# EAGLE design Truss-Power (EAGLE 7.7.0)
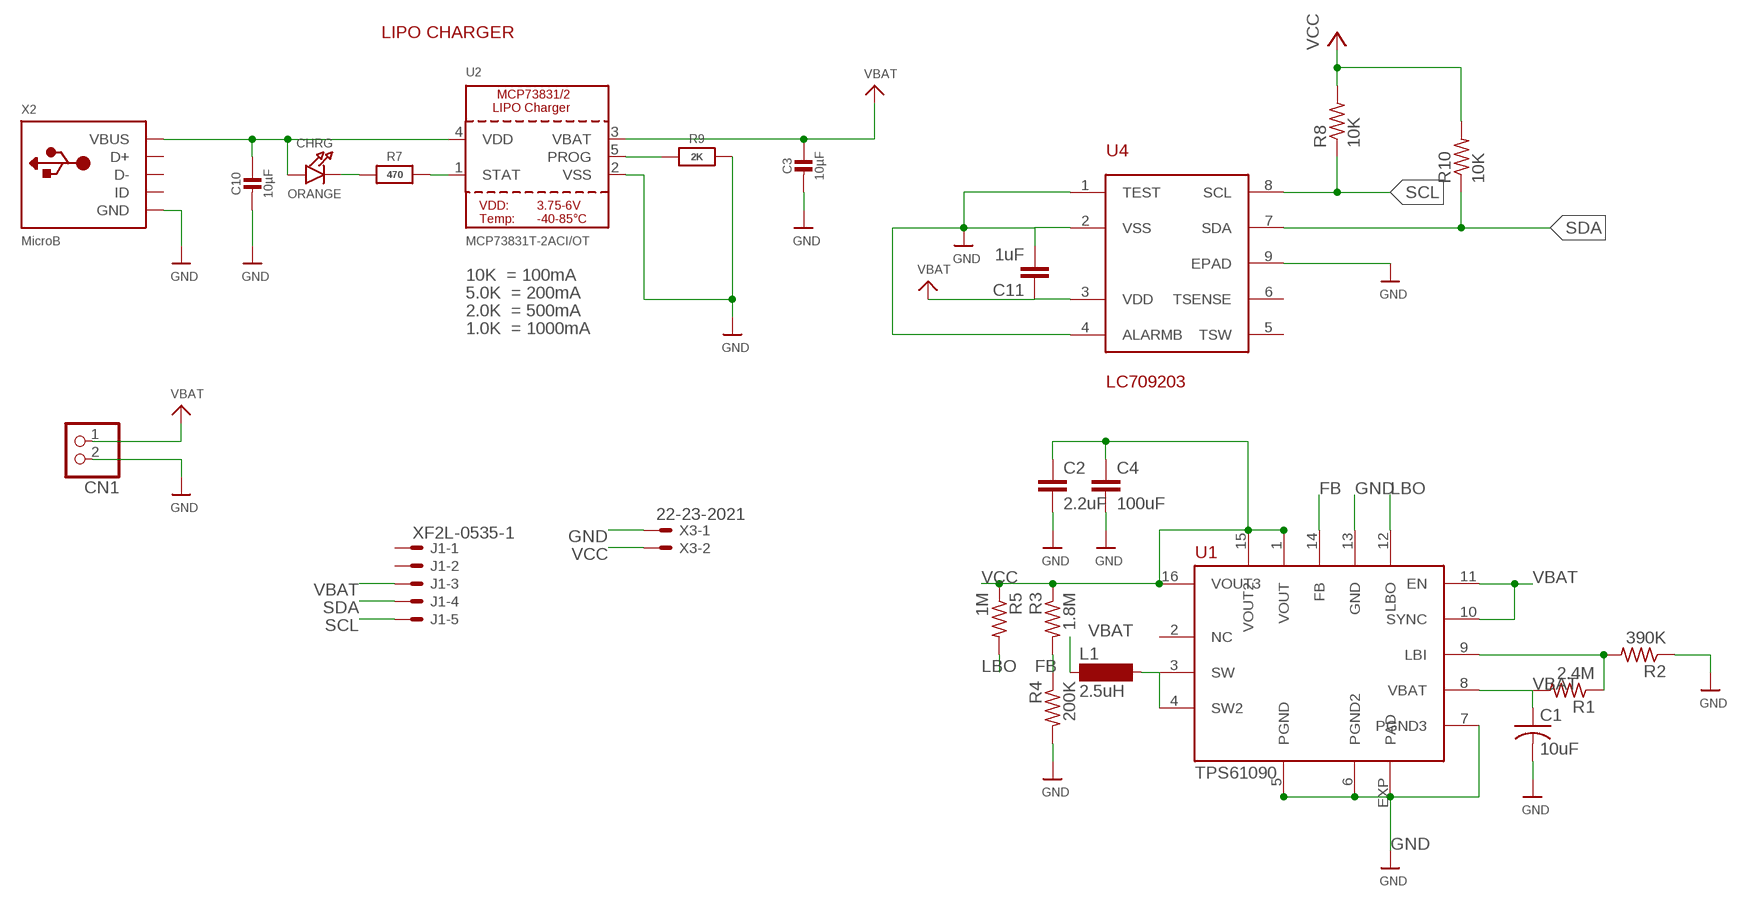
[diagram p0: schematic, sheet 1]

## Parts
C1  10uF  C-USC0805K  [C0805K]
C2  2.2uF  C-EUC0805K  [C0805K]
C3  10µF  CAP_CERAMIC0805-NOOUTLINE  [0805-NO]
C4  100uF  TANT-CAP  [7343-METRIC]
C10  10µF  CAP_CERAMIC0805-NOOUTLINE  [0805-NO]
C11  1uF  C-EUC0603  [C0603]
CHRG  ORANGE  LED0805_NOOUTLINE  [CHIPLED_0805_NOOUTLINE]
CN1  JST_2PIN-SMT-RA  [JST-PH-2-SMT-RA]
J1  XF2L-0535-1  [XF2L-0535-1]
L1  2.5uH  CDRH5D28  [CDRH5D28]
R1  2.4M  R-US_R0603  [R0603]
R2  390K  R-US_R0603  [R0603]
R3  1.8M  R-US_R0603  [R0603]
R4  200K  R-US_R0603  [R0603]
R5  1M  R-US_R0603  [R0603]
R7  470  RESISTOR0805_NOOUTLINE  [0805-NO]
R8  10K  R-US_R0402  [R0402]
R9  2K  RESISTOR0805_NOOUTLINE  [0805-NO]
R10  10K  R-US_R0402  [R0402]
U1  TPS61090  [TPS61090]
U2  MCP73831T-2ACI/OT  MCP73831/2  [SOT23-5]
U4  LC709203  [WDFN8]
X2  MicroB  USBMICRO_20329  [4UCONN_20329]
X3  22-23-2021  [22-23-2021]

## Nets
FB: R3.2 R4.1 U1.14(FB)
GND: C1.2 C2.2 C3.2 C4.2 C10.2 C11.2 CN1.2 R2.1 R4.2 R9.2 U1.5(PGND) U1.6(PGND2) U1.7(PGND3) U1.13(GND) U1.EXP(PAD) U2.2(VSS) U4.1(TEST) U4.2(VSS) U4.4(ALARMB) U4.9(EPAD) X2.BASE@1(GND) X2.BASE@2(GND) X2.GND X2.SPRT@1(GND) X2.SPRT@2(GND) X2.SPRT@3(GND) X2.SPRT@4(GND) X3.1
LBI: R1.1 R2.2 U1.9(LBI)
LBO: R5.2 U1.12(LBO)
N$12: CHRG.C R7.1
N$13: R7.2 U2.1(STAT)
N$14: R9.1 U2.5(PROG)
SCL: J1.5 R8.1 U4.8(SCL)
SDA: J1.4 R10.1 U4.7(SDA)
SW: L1.2 U1.3(SW) U1.4(SW2)
VBAT: C1.1 C3.1 C11.1 CN1.1 J1.3 L1.1 R1.2 U1.8(VBAT) U1.10(SYNC) U1.11(EN) U2.3(VBAT) U4.3(VDD)
VBUS: C10.1 CHRG.A U2.4(VDD) X2.VBUS
VCC: C2.1 C4.1 R3.1 R5.1 R8.2 R10.2 U1.1(VOUT) U1.15(VOUT2) U1.16(VOUT3) X3.2
Unconnected: J1.1 J1.2 U1.2(NC) U4.5(TSW) U4.6(TSENSE) X2.D+ X2.D- X2.ID

## Notes on the sheet
- LIPO CHARGER
- 10K  = 100mA
- 5.0K  = 200mA
- 2.0K  = 500mA
- 1.0K  = 1000mA

## Library data of the parts
C1 = adafruit:C-US: CAPACITOR, American symbol
C2 C11 = rcl:C-EU: CAPACITOR, European symbol
C3 C10 = microbuilder:CAP_CERAMIC: Ceramic Capacitors For new designs, use the packages preceded by an '_' character since they are more reliable: The following footprints should be used on most boards: _0402 - Standard footprint for regular board layouts _0603 - Standard footprint for regular board layouts _0805 - Standard footprint for regular board layouts _1206 - Standard footprint for regular board layouts For extremely tight-pitch boards where space is at a premium, the following 'micro-pitch' footprints can be used (smaller pads, no silkscreen outline, etc.): _0402MP - Micro-pitch footprint for very dense/compact boards _0603MP - Micro-pitch footprint for very dense/compact boards _0805MP - Micro-pitch footprint for very dense/compact boards _1206MP - Micro-pitch footprint for very dense/compact boards
C4 = NewPart:TANT-CAP: 7343(Metric) Tantalum Capacitor
CHRG = microbuilder:LED: LED 0603 - 0603 Surface Mount Package 2mA: Green LED - Low Power (3.9mcd, 2ma, 1.7Vf) - Digikey: 475-2709-2-ND Orange LED - Low Power (9.8mcd, 2ma, 1.8Vf) - Digikey: 475-1194-2-ND Red LED - Low Power (5mcd, 2ma, 1.8Vf) - Digikey: 475-1195-2-ND Yellow LED - Low Power (7mcd, 2ma, 1.8Vf) - Digikey: 475-1196-2-ND 5mA: Blue LED - Low Power (17mcd, 5ma, 2.9Vf) - Digikey: LNJ937W8CRACT-ND 0805 - 0805 Surface Mount Package 2mA: Red LED (8.8mcd, 2mA, 1.8Vf, Clear) - Low Power [Digikey: 475-2510-1-ND] Green LED (5mcd, 2mA, 1.8Vf, Clear) - Low Power [Digikey: 475-2730-1-ND] Yellow LED (11.3mcd, 2mA, 1.8Vf, Clear) - Low Power [Digikey: 475-2555-1-ND] 20mA: Red LED (104mcd, 20mA, Diffused) - LS R976 [Digikey: 475-1278-6-ND] Red LED (12mcd, 20mA, 2.0Vf, Clear) - APT2012EC [Digikey: 754-1128-1-ND] Green LED (15mcd, 20mA, 2.2Vf, Clear) - APT2012GC [Digikey: 754-1131-1-ND] Orange LED (160mcd, 20mA, 2.1Vf, Clear) - APT2012SECK [Digikey: 754-1130-1-ND] 1206 - 1206 Surface Mount Package Green LED (26mcd, 20mA, Diffused) - LG N971 [Digikey: 475-1407-6-ND] Red LED (15mcd, 20mA, Diffused) - LH N974 [Digikey: 475-1416-6-ND] Cree - Cree High-Power Surface Mount LEDs XPEBWT-L1-0000-00D50 - White 111lm 350mA 2.9Vf 6200K 110° XTEAWT-00-0000-00000LEE3 - White 114lm 350mA 2.85Vf 5000K 115° Everlight - Everlight 45-21 Series Surface Mount LEDs 45-21/QK2C-B2832AC2CB2/2T - Warm White 2000mcd 20mA 3.25Vf 3050K 120° 45-21/LK2C-B38452C4CB2/2T - Nuetral White 2000mcd 20mA 3.25Vf 4150K 120° 45-21/LK2C-B50634C6CB2/2T - Cold White 2200mcd 20mA 3.25Vf 5650K 120° PLCC2 Reverse Mount LS T77K-J1L2-1-0-2-R18-Z - Red 11.25mcd 2mA 1.8Vf 630nm 120° LO T77K-L1M2-24-Z - Orange 19.6mcd 2mA 1.8Vf 606nm 120° LY T77K-K2M1-26-Z - Yellow 15.7mcd 2mA 1.8Vf 587nm 120°
CN1 = adafruit:JST_2PIN: JST 2-Pin Connectors of various flavors SMT-RA (S2B-PH-SM4) 4UConnector #17311 SMT (B2B-PH-SM4) THM-RA (S2B-PH) THM (B2B-PH)
J1 = con-omron:XF2*-05?: OMRON FPC Connector Source : http://www.omron.com/ecb/products/pdf/fpc.pdf; MPN: XF2L-0535-1A; OC_FARNELL: unknown; OC_NEWARK: 37M0863
L1 = NewPart:CDRH5D28: Sumida CDRH5D28 Inductor
R1-R5 = adafruit:R-US_: RESISTOR, American symbol
R7 R9 = microbuilder:RESISTOR: Resistors For new designs, use the packages preceded by an '_' character since they are more reliable: The following footprints should be used on most boards: _0402 - Standard footprint for regular board layouts _0603 - Standard footprint for regular board layouts _0805 - Standard footprint for regular board layouts _1206 - Standard footprint for regular board layouts For extremely tight-pitch boards where space is at a premium, the following 'micro-pitch' footprints can be used (smaller pads, no silkscreen outline, etc.): _0402MP - Micro-pitch footprint for very dense/compact boards _0603MP - Micro-pitch footprint for very dense/compact boards _0805MP - Micro-pitch footprint for very dense/compact boards _1206MP - Micro-pitch footprint for very dense/compact boards
R8 R10 = resistor:R-US_: RESISTOR, American symbol
U1 = NewPart:TPS61090: TI TPS61090 Boost Regulator
U2 = microbuilder:MCP73831/2: MCP73831/2 LIPO Charger VDD: 3.75 - 6V Temp -40 - 85°C Programmable Charge Rate: 15-500mA NOTE: STAT is a tri-state logic output on the MCP73831 and an open-drain output on the MCP73832. SOT23-5 with 4.2V output and tri-state logic on STAT = MCP73831T-2ACI/OT
U4 = NewPart:LC709203: 1-cell ON semiconductor gas gauge
X2 = microbuilder:USB: USB Connectors USBMINIB - Surface Mount Female Mini-B USB Connector 4UConnector: 06564
X3 = con-molex:22-23-2021: .100" (2.54mm) Center Header - 2 Pin; MF: MOLEX; MPN: 22-23-2021; OC_FARNELL: 1462926; OC_NEWARK: 25C3832

## Board
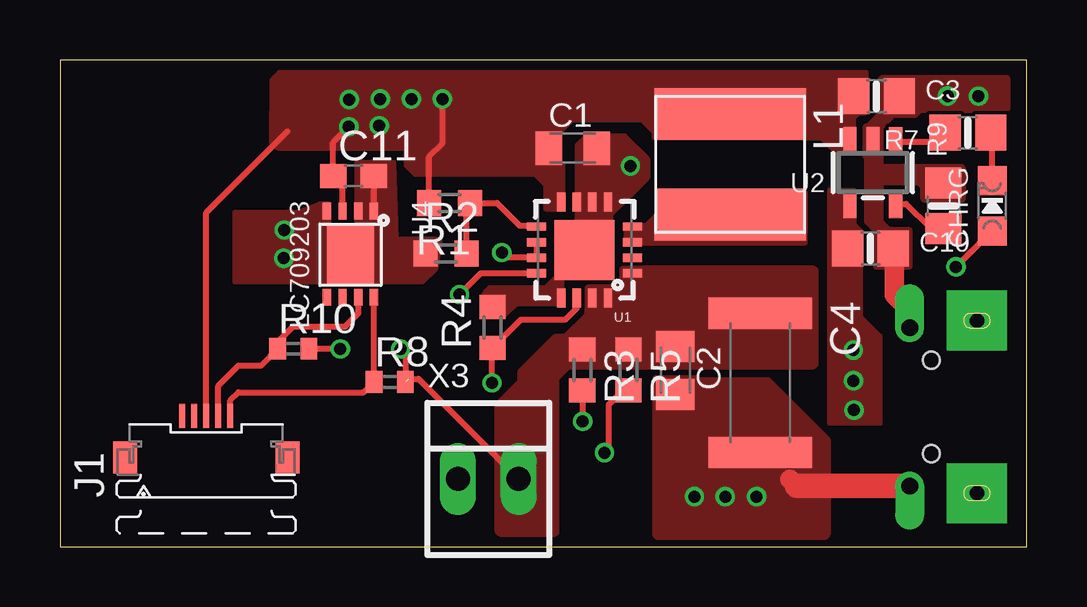
[diagram p1: board, top side]
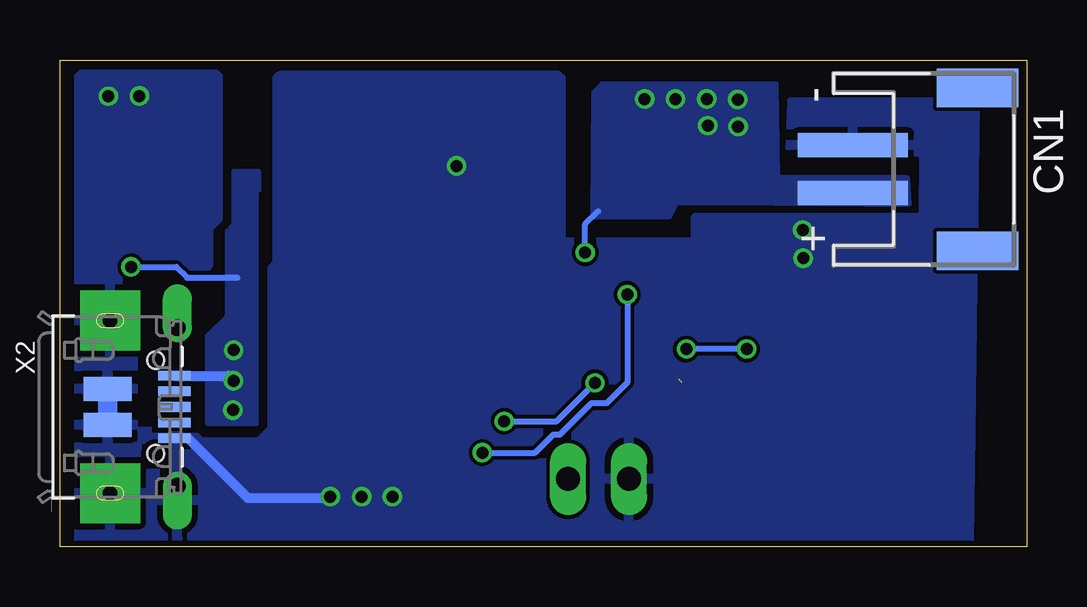
[diagram p2: board, bottom side, seen from below]

Size 40.31 x 20.31 mm. Coordinates in mm from the lower left corner, seen from the top.
Outline: 0,0 40.31,0 40.31,20.31 0,20.31 0,0
Copper layers (1*16): Top 0.035mm / dielectric 1.5mm / Bottom 0.035mm
Design rules "SeeedStudio_2layer_DRU_no_angle_20140221": minimum track width 6mil, minimum drill 12mil, track to track 6mil, track to pad 6mil, pad to pad 6mil, via to via 6mil, smd to smd 0mil, copper to edge 10mil, drill to drill 10mil, minimum pad ring 10mil, minimum via ring 6mil, stop-mask expansion 2mil, vias tented up to drill 100mil, thermal gap 10mil

### Footprints (pad centres in the part's own frame; a part is rotated, then mirrored left to right if it is on the bottom)
C0805K = smd 1.1 x 1.4: 1 -1,0; 2 1,0
C0805K' = smd 1.3 x 1.6: 1 -1,0; 2 1,0
0805-NO = smd 1.3 x 1.5: 1 -0.95,0; 2 0.95,0
7343-METRIC = smd 1.3 x 4.3: 1 -3.4,1.5; 2 2.4,1.5
C0603 = smd 1.1 x 1: 1 -0.85,0; 2 0.85,0
CHIPLED_0805_NOOUTLINE = smd 1.2 x 1.2: A 0,-1.05; C 0,1.05
JST-PH-2-SMT-RA = smd 1 x 4.6: 1 1,-3.7; 2 -1,-3.7 | smd 1.6 x 3.4: NC1 -3.4,1.5; NC2 3.4,1.5
XF2L-0535-1 = smd 1 x 0.25: 1 1.905,1; 2 1.905,0.5; 3 1.905,0; 4 1.905,-0.5; 5 1.905,-1 | smd 1.34 x 1: M1 0.18,3.388; M2 0.18,-3.388
CDRH5D28 = smd 2.15 x 6.3: 1 -2.05,0; 2 2.14,0
R0603 = smd 1 x 1.1: 1 -0.85,0; 2 0.85,0
R0402 = smd 0.7 x 0.9: 1 -0.65,0; 2 0.65,0
TPS61090 = smd 0.8 x 0.35: 1 -2,0.975; 2 -2,0.325; 3 -2,-0.325; 4 -2,-0.975; 9 2,-0.975; 10 2,-0.325; 11 2,0.325; 12 2,0.975 | smd 0.35 x 0.8: 5 -0.975,-2; 6 -0.325,-2; 7 0.325,-2; 8 0.975,-2; 13 0.975,2; 14 0.325,2; 15 -0.325,2; 16 -0.975,2 | smd 2.5 x 2.5: EXP 0,0
SOT23-5 = smd 0.55 x 1.2: 1 -0.95,-1.3; 2 0,-1.3; 3 0.95,-1.3; 4 0.95,1.3; 5 -0.95,1.3
WDFN8 = smd 0.35 x 0.7: 1 -0.975,-2.095; 2 -0.325,-2.095; 3 0.325,-2.095; 4 0.975,-2.095; 5 0.975,1.495; 6 0.325,1.495; 7 -0.325,1.495; 8 -0.975,1.495 | smd 1.96 x 2.56: 9 0,-0.3
4UCONN_20329 = smd 1 x 2: BASE@1 -0.75,-2; BASE@2 0.75,-2 | smd 0.4 x 1.35: D+ 0,0.775; D- -0.65,0.775; GND 1.3,0.775; ID 0.65,0.775; VBUS -1.3,0.775 | drill 0.7 offset: SPRT@1 -3.3,0.9; SPRT@2 3.3,0.9 | drill 0.6 pad 2.5 square: SPRT@3 -3.6,-1.9; SPRT@4 3.6,-1.9 | hole 0.7: -1.95,0; 1.95,0
22-23-2021 = drill 1 long: 1 -1.27,0; 2 1.27,0

### Placement (x,y rotation side)
C1  21.37,16.63 0 top
C2  2.2uF  [C0805K']  25.65,7.37 270 top
C3  34.04,18.8 0 top
C4  27.69,6.35 270 top
C10  33.78,12.45 0 top
C11  12.24,15.47 0 top
CHRG  38.86,14.22 0 top
CN1  3.56,15.75 270 bottom
J1  6.1,3.56 90 top
L1  27.94,16 270 top
R1  16.24,14.34 180 top
R2  16.09,12.24 0 top
R3  21.77,7.38 270 top
R4  18.03,9.15 90 top
R5  23.7,7.38 270 top
R7  37.85,17.27 180 top
R8  13.75,6.88 0 top
R9  36.83,14.22 90 top
R10  9.73,8.27 0 top
U1  21.87,12.39 180 top
U2  33.88,15.61 180 top
U4  12.11,11.91 180 top
X2  36.32,5.84 270 bottom
X3  17.85,2.83 0 top

### Tracks (layer width: path | path; a pad name or v marks a point on that pad's centre or on a via)
FB  (via drill 0.5 pad 0.25)
  Top 0.254: U1.14 21.55,9.96 21.05,9.47 19.2,9.47 R4.1 18.01,8.28 v18.01,6.84 | R3.2 21.77,5.26 v21.79,5.24
  Bottom 0.254: v21.79,5.24 19.61,5.24 v18.01,6.84
GND  (via drill 0.5)
  Top 0.254: U4.1 C11.2
  Top 0.813: X2.SPRT@1 35.42,9.88 34.79,10.51 34.79,12.39 C10.2 | 30.72,2.54 30.43,2.83
  Top 1.016: X2.SPRT@2 30.72,2.54
  Bottom 0.406: X2.GND 34.98,4.54 32.48,2.04 29.1,2.04 v29.04,2.1
  Bottom 0.813: X2.BASE@1 X2.BASE@2
  other vias: 37,18.81 38.29,18.8 9.35,13.22 9.33,12.04 23.78,15.89 26.45,2.1 27.73,2.1
  pour Top (no thermals): 34.33,19.57 39.46,19.57 39.48,19.55 39.48,18.25 39.45,18.22 35.85,18.22 35.64,18.01 34.71,18.01 34.19,17.49 34.19,15.9 34.23,15.86 37.58,15.86 37.63,15.81 37.63,14.51 37.59,14.47 36.04,14.47 35.99,14.52 35.99,15 35.8,15.19 34.21,15.19 34.19,15.17 34.19,13.58 34.54,13.23 35.38,13.23 35.41,13.2 35.41,11.71 35.37,11.67 34.05,11.67 34.04,11.68 34.04,13.16 33.65,13.55 33.65,16.23 33.59,16.29 33.59,17.51 33.61,17.53 33.67,17.53 34.19,18.05 34.19,19.47 34.29,19.57
  pour Top (no thermals): 24.85,7.04 26.56,7.04 26.63,6.97 29.51,6.97 32.01,4.47 32.01,0.53 31.89,0.41 25,0.41 24.9,0.41 24.82,0.49 24.82,7.01
  pour Bottom: 9.81,18.55 9.89,16.48 4.29,16.48 4.32,13.73 13.82,13.72 13.83,12.69 19.27,12.69 19.42,12.84 19.42,19.53 19.54,19.65 31.13,19.65 31.25,19.53 31.25,11.81 31.47,11.59 31.47,4.92 32.02,4.37 34.45,4.37 34.88,4.8 37.25,4.8 37.25,10.97 36.51,11.71 34.17,11.71 34.12,11.76 34.12,13.33 33.71,13.74 33.71,19.6 33.81,19.7 39.42,19.7 39.52,19.6 39.52,0.29 39.37,0.14 2.53,0.14 2.41,0.26 2.16,18.52
  pour Top (no thermals): 22.02,17.14 23.52,17.14 24.46,16.2 24.46,15.39 23.03,13.96 22.93,13.86 22.93,11.35 22.93,11.33 21.04,11.33 20.89,11.18 20.89,10.16 19,10.16 18.55,9.71 17.72,9.71 17.72,10.59 17.92,10.79 20.25,10.79 20.84,11.38 20.81,11.41 20.81,13.46 21.59,13.46 21.59,15.03 21.59,16.75 21.98,17.14
  pour Top (no thermals): 7.32,13.94 9.95,13.94 10.86,14.3 11.17,14.3 11.17,13.34 12.4,13.34 12.4,16.03 13.89,16.03 13.99,12.83 15.83,12.83 15.63,11.6 15.09,11.06 7.32,11.06
LBI
  Top 0.254: R2.2 16.94,14.19 R1.1 18.22,14.34 19.16,13.4 19.83,13.4 U1.9
LBO  (via drill 0.5)
  Top 0.254: R5.2 23.47,6.53 22.87,5.93 22.87,4.1 v22.7,3.93 | U1.12 17.54,11.41 v16.66,10.53
  Bottom 0.254: v22.7,3.93 20.5,3.93 19.74,4.69 19.47,4.69 18.17,5.99 17.53,5.99 16.66,6.86 v16.66,10.53
N$12
  Top 0.254: CHRG.C 38.86,17.21 R7.1
N$13
  Top 0.254: U2.1 36.53,16.91 R7.2
N$14
  Top 0.254: U2.5 35.27,14.31 36.26,13.32 36.78,13.32 R9.1
SCL
  Top 0.254: U4.8 13.08,6.9 R8.1 12.66,6.45 7.44,6.45 7.1,6.11 J1.5
SDA
  Top 0.254: U4.7 12.43,9.74 11.89,9.2 9.73,9.2 9.08,8.54 R10.1 8.38,7.57 7.44,7.57 6.6,6.72 J1.4
SW
  pour Top (no thermals): 23.66,13.41 24.47,13.41 24.95,13.89 24.95,14.79 31.04,14.79 31.04,12.68 23.64,12.68 23.64,13.41
VBAT  (via drill 0.5)
  Top 0.254: U4.3 11.78,15.07 C11.1 11.39,16.88 v12.04,17.53 | v18.42,12.28 18.64,12.06 U1.11 U1.10 | R1.2 15.39,16.28 15.94,16.83 v15.94,18.68 | J1.3 6.1,13.95 9.47,17.32
  Bottom 0.254: v18.42,12.28 18.42,13.46 17.88,13.99
  other vias: 12.06,18.66 13.35,18.68 14.65,18.68 13.31,17.57
  pour Bottom (no thermals): 10.46,19.28 17.7,19.28 18.05,18.93 18.1,13.81 18.01,13.79 14.91,13.79 14.62,14.36 14.59,14.39 12.39,14.38 4.93,14.3 4.99,15.38 10.4,15.41
  pour Top (no thermals): 8.82,16.91 9.07,16.65 14.45,16.65 14.45,15.92 14.81,15.56 19.81,15.56 20.26,15.11 20.26,14.12 20.95,14.12 20.95,15.93 20.78,16.1 20.78,17.27 21.35,17.84 24.26,17.84 24.78,17.32 24.78,17.1 31.75,17.1 32.38,16.47 33.08,16.47 33.08,17.9 33.32,18.14 33.6,18.14 33.6,19.76 9.15,19.76 8.85,19.45
VBUS  (via drill 0.5)
  Top 0.254: CHRG.A 38.84,13.17 v37.35,11.68
  Bottom 0.254: v37.35,11.68 35.46,11.68 35.01,11.23 32.92,11.23
  Bottom 0.406: X2.VBUS 33.29,7.14 v33.08,6.93
  other vias: 33.07,8.21 33.1,5.71
  pour Top (no thermals): 32.32,14.87 33.07,14.87 33.07,13.75 33.07,13.45 33.35,13.17 33.35,9.59 34.16,8.78 34.16,5.17 32.11,5.17 32.11,14.87 32.29,14.87
  pour Bottom (no thermals): 32.03,15.64 33.05,15.64 33.05,13.42 33.33,13.14 33.33,9.62 34.15,8.8 34.15,5.17 32.13,5.17 32.13,14.89 32.03,14.89
VCC  (via drill 0.5)  (1 unrouted)
  Top 0.254: X3.2 14.94,7.02 14.53,7.02 | R10.2 v11.68,8.27 v11.68,8.26 | v14.2,8.26 14.4,8.06 R8.2
  Bottom 0.254: v11.68,8.26 v14.2,8.26
  pour Top (no thermals): 18.22,5.93 18.22,0.68 18.34,0.56 20.63,0.56 20.7,0.63 20.7,7.03 21.2,7.53 31.41,7.53 31.51,7.63 31.51,11.52 31.42,11.61 23.46,11.61 23.42,11.57 23.42,10.84 23.4,10.82 22.01,10.82 21.96,10.77 21.96,9.67 21.04,8.75 20.64,8.75 19.18,7.29 19.18,6.89